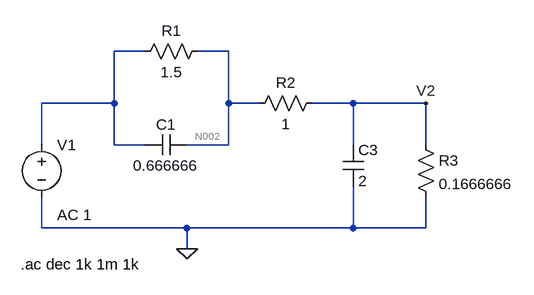
[diagram p0: schematic Ej2_Z11.asc]
Ej2_Z11.asc, the LTspice schematic file:
Version 4
SHEET 1 880 680
WIRE 48 128 0 128
WIRE 176 128 128 128
WIRE 0 208 0 128
WIRE 0 208 -112 208
WIRE 176 208 176 128
WIRE 224 208 176 208
WIRE 368 208 304 208
WIRE 480 208 368 208
WIRE -112 272 -112 208
WIRE 0 272 0 208
WIRE 48 272 0 272
WIRE 176 272 176 208
WIRE 176 272 112 272
WIRE 368 272 368 208
WIRE 480 272 480 208
WIRE -112 400 -112 352
WIRE 112 400 -112 400
WIRE 368 400 368 336
WIRE 368 400 112 400
WIRE 480 400 480 352
WIRE 480 400 368 400
WIRE 112 432 112 400
FLAG 112 432 0
FLAG 480 208 V2
SYMBOL res 144 112 R90
WINDOW 0 0 56 VBottom 2
WINDOW 3 32 56 VTop 2
SYMATTR InstName R1
SYMATTR Value 1.5
SYMBOL res 320 192 R90
WINDOW 0 0 56 VBottom 2
WINDOW 3 32 56 VTop 2
SYMATTR InstName R2
SYMATTR Value 1
SYMBOL cap 352 272 R0
SYMATTR InstName C3
SYMATTR Value 2
SYMBOL res 464 256 R0
SYMATTR InstName R3
SYMATTR Value 0.1666666
SYMBOL voltage -112 256 R0
WINDOW 123 24 124 Left 2
WINDOW 39 0 0 Left 0
SYMATTR Value2 AC 1
SYMATTR InstName V1
SYMATTR Value ""
SYMBOL cap 112 256 R90
WINDOW 0 0 32 VBottom 2
WINDOW 3 32 32 VTop 2
SYMATTR InstName C1
SYMATTR Value 0.666666
TEXT -144 456 Left 2 !.ac dec 1k 1m 1k

The netlist it stands for:
* Ej2_Z11.asc
R1 N002 N001 1.5
R2 V2 N002 1
C3 V2 0 2
R3 V2 0 0.1666666
V1 N001 0 AC 1
C1 N002 N001 0.666666
.ac dec 1k 1m 1k
.backanno
.end

* Results of the author's LTspice run, read from the files saved beside the schematic
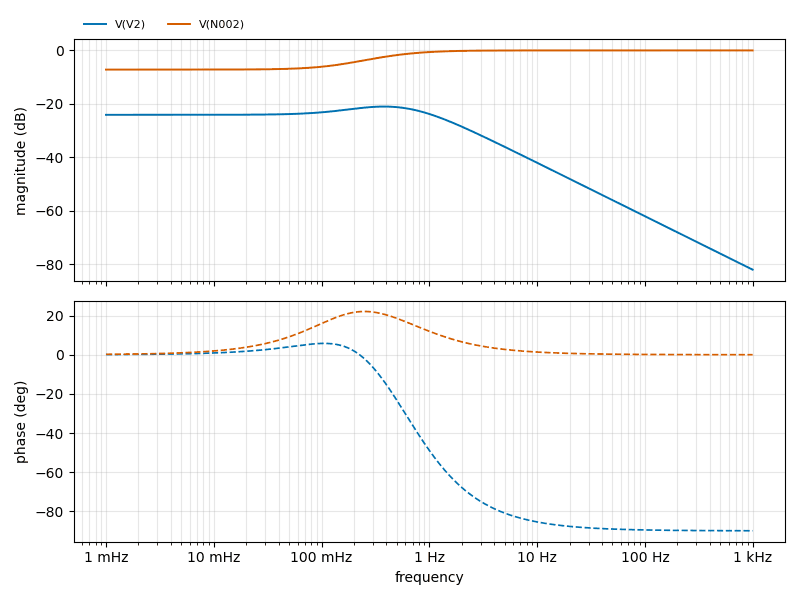
[diagram p1: AC Analysis of Ej2_Z11.asc, plotted from the saved traces]
* AC Analysis, 1 run:
*   V(V2): -24.08 dB at 1 mHz, -81.98 dB at 1 kHz, peak -20.99 dB at 380.2 mHz, 3 dB below the peak at 26.28 mHz and 1.041 Hz
*   V(N002): -7.18 dB at 1 mHz, -0.00 dB at 1 kHz, peak -0.00 dB at 1 kHz, 3 dB below the peak at 311.3 mHz